# EasyEDA Pro project 4040M主控板v1.0_原理图.eprj

# Schematic 原理图
Board Name: MCU+U盘; Create Date: 2024-04-22; Page Name: 主控MCU; Project Name: 4040M主控板v1.0_原理图; Schematic Name: 原理图; Update Date: 2026-04-30; Company: 嘉立创EDA; Page Size: A3; Version: V1.0
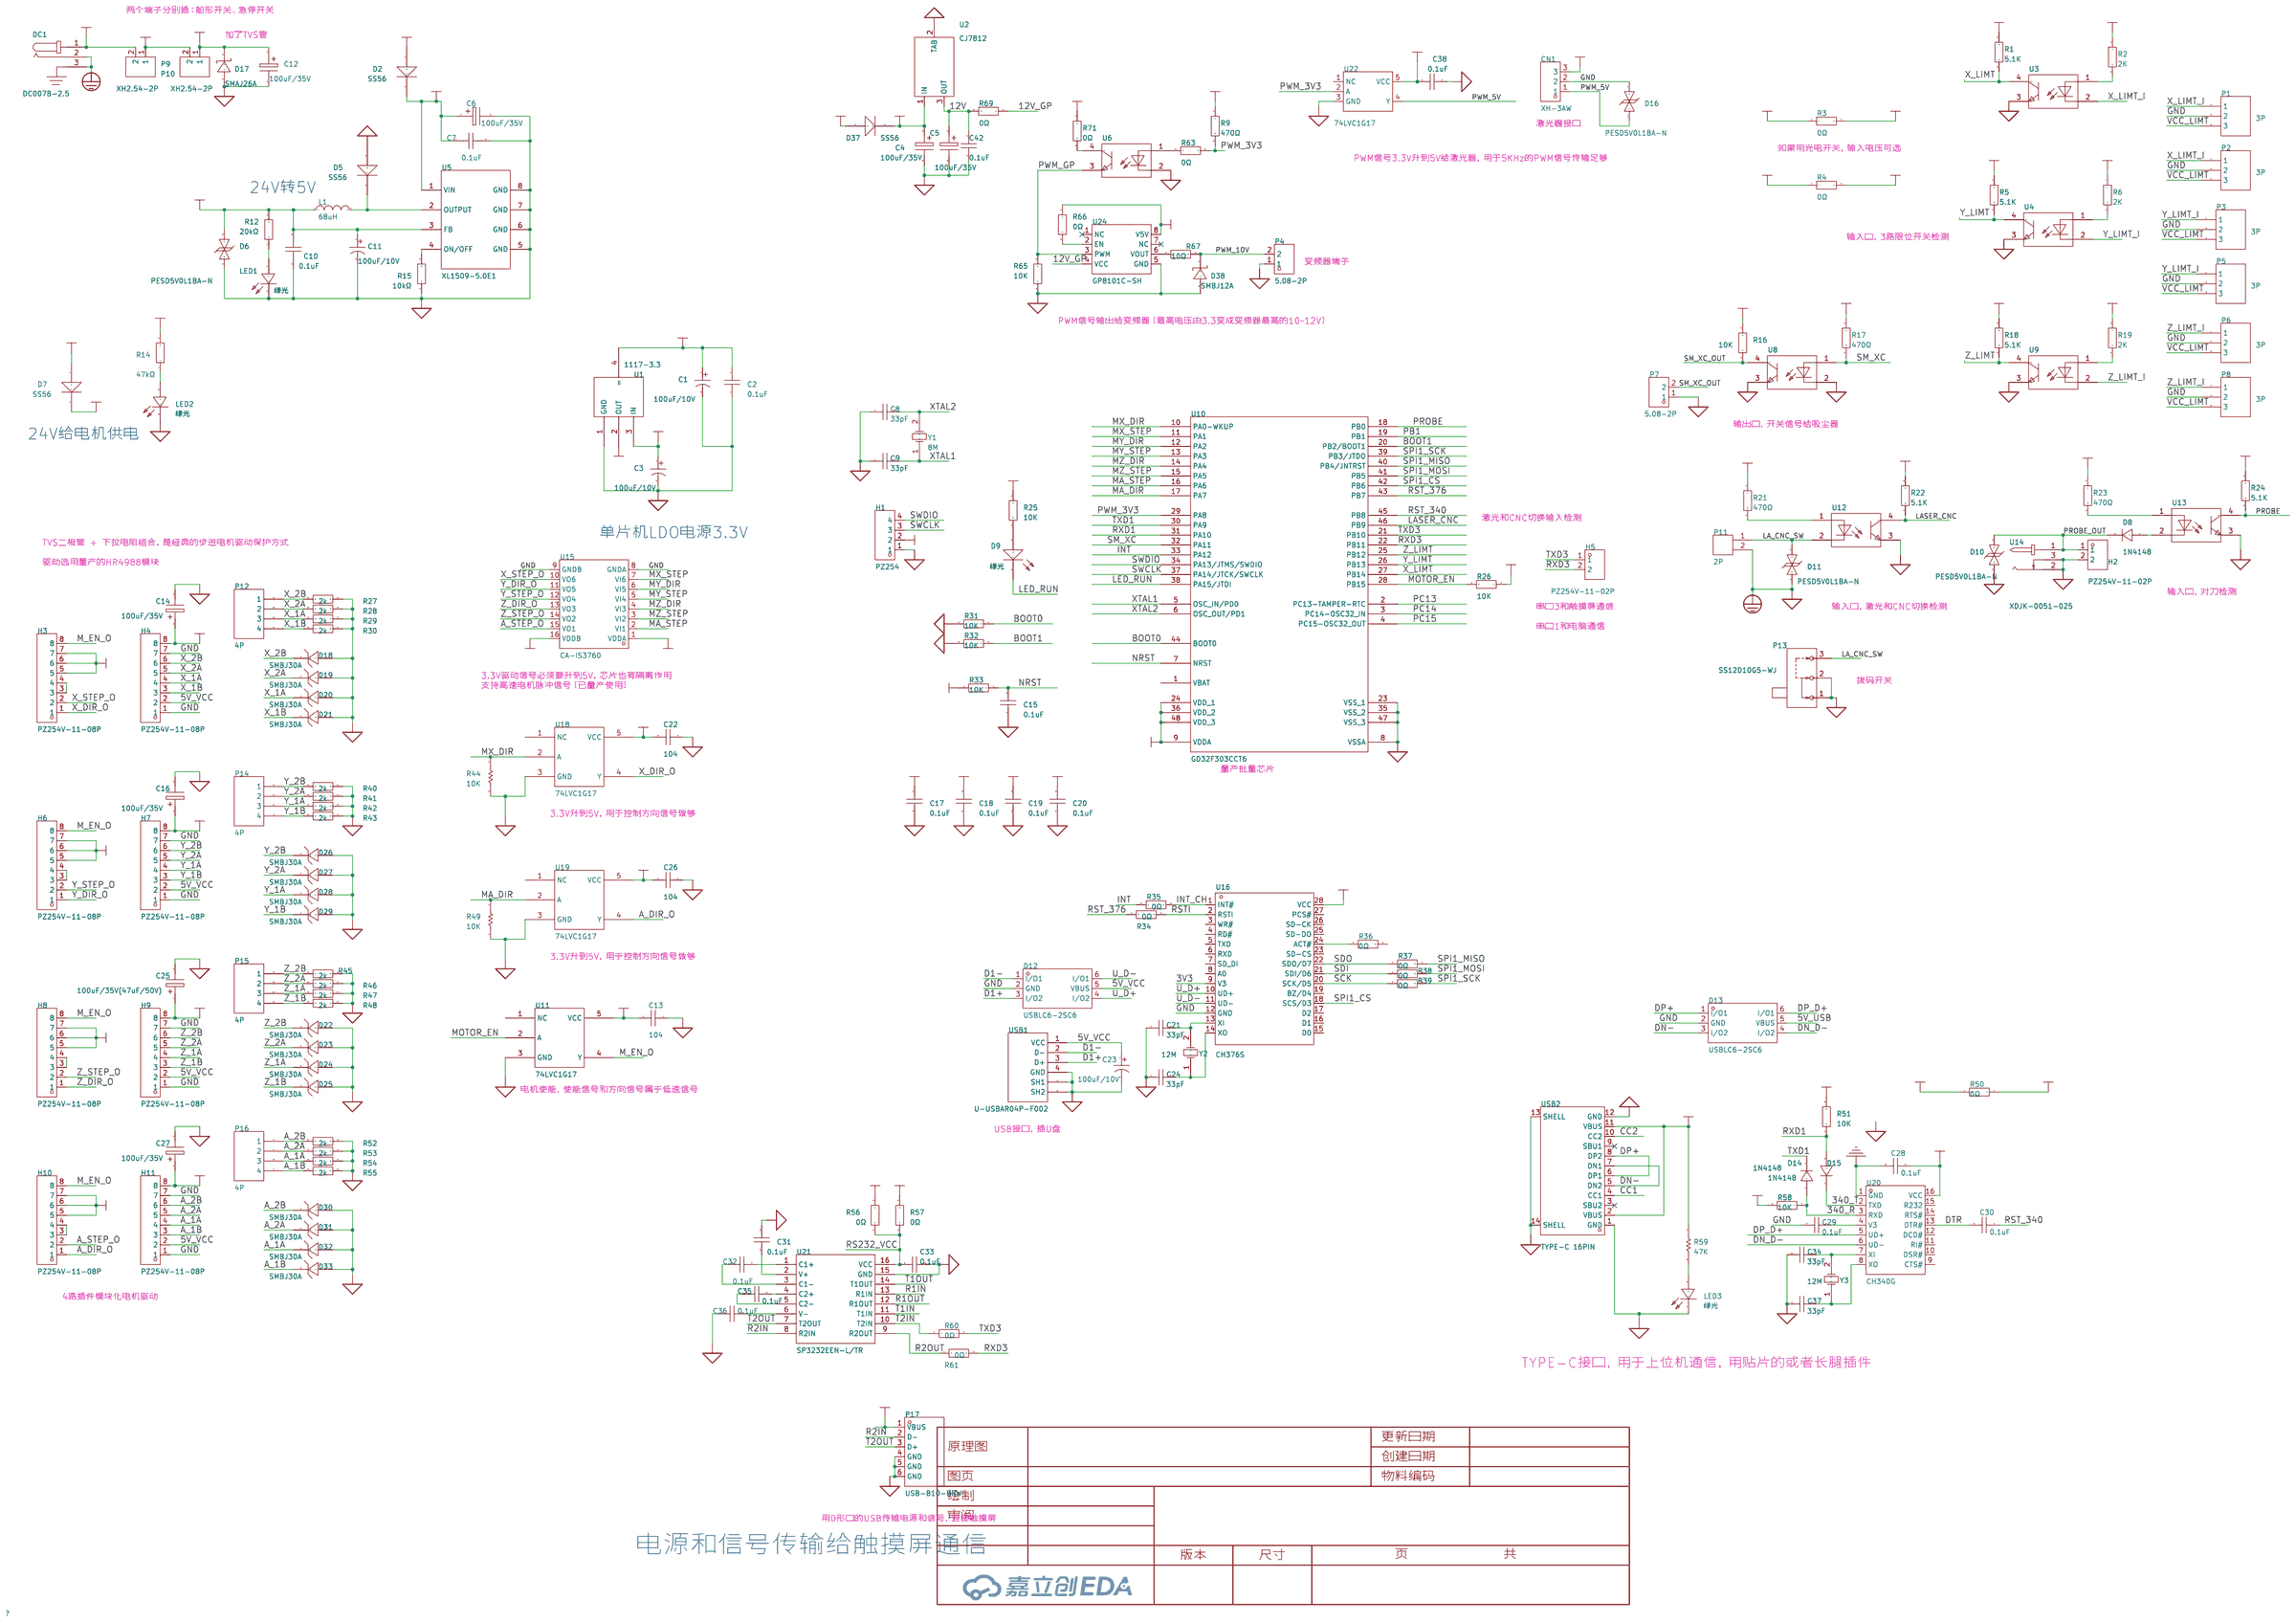
[diagram p0: schematic sheet]

## Parts
C1  100uF/10V  [CAP-SMD_BD5.0-L5.3-W5.3-RD]
C2  0.1uF  [C0603]
C3  100uF/10V  [CAP-SMD_BD5.0-L5.3-W5.3-RD]
C4  100uF/35V  [电解电容贴片6X6]
C5  100uF/35V  [电解电容贴片6X6]
C6  100uF/35V  [电解电容贴片6X6]
C7  0.1uF  [C0603]
C8  33pF  [C0603]
C9  33pF  [C0603]
C10  0.1uF  [C0603]
C11  100uF/10V  [CAP-SMD_BD5.0-L5.3-W5.3-RD]
C12  100uF/35V  [电解电容贴片6X6]
C13  104  [0603C]
C14  100uF/35V  [电解电容贴片6X6]
C15  0.1uF  [C0603]
C16  100uF/35V  [电解电容贴片6X6]
C17  0.1uF  [C0603]
C18  0.1uF  [C0603]
C19  0.1uF  [C0603]
C20  0.1uF  [C0603]
C21  33pF  [C0603]
C22  104  [0603C]
C23  100uF/10V  [CAP-SMD_BD5.0-L5.3-W5.3-RD]
C24  33pF  [C0603]
C25  100uF/35V(47uF/50V)  [电解电容贴片6X6]
C26  104  [0603C]
C27  100uF/35V  [电解电容贴片6X6]
C28  0.1uF  [C0603]
C29  0.1uF  [C0603]
C30  0.1uF  [C0603]
C31  0.1uF  [C0603]
C32  0.1uF  [C0603]
C33  0.1uF  [C0603]
C34  33pF  [C0603]
C35  0.1uF  [C0603]
C36  0.1uF  [C0603]
C37  33pF  [C0603]
C38  0.1uF  [C0603]
C42  0.1uF  [C0603]
CN1  XH-3AW  [CONN-TH_3P-P2.54_HCTL_XH-3AW]
D2  SS56  [SMA]
D5  SS56  [SMA]
D6  PESD5V0L1BA-N  [SOD-323_L1.8-W1.3-LS2.5-BI]
D7  SS56  [SMA]
D8  1N4148  [SOD-323_L1.8-W1.3-LS2.5-RD]
D9  绿光  [0603LED]
D10  PESD5V0L1BA-N  [SOD-323_L1.8-W1.3-LS2.5-BI]
D11  PESD5V0L1BA-N  [SOD-323_L1.8-W1.3-LS2.5-BI]
D12  USBLC6-2SC6  [SOT-23-6_L2.9-W1.6-P0.95-LS2.8-BL]
D13  USBLC6-2SC6  [SOT-23-6_L2.9-W1.6-P0.95-LS2.8-BL]
D14  1N4148  [SOD-323_L1.8-W1.3-LS2.5-RD]
D15  1N4148  [SOD-323_L1.8-W1.3-LS2.5-RD]
D16  PESD5V0L1BA-N  [SOD-323_L1.8-W1.3-LS2.5-BI]
D17  SMAJ26A  [SMA_L4.4-W2.8-LS5.1-RD]
D18  SMBJ30A  [SMB_L4.6-W3.6-LS5.3-RD]
D19  SMBJ30A  [SMB_L4.6-W3.6-LS5.3-RD]
D20  SMBJ30A  [SMB_L4.6-W3.6-LS5.3-RD]
D21  SMBJ30A  [SMB_L4.6-W3.6-LS5.3-RD]
D22  SMBJ30A  [SMB_L4.6-W3.6-LS5.3-RD]
D23  SMBJ30A  [SMB_L4.6-W3.6-LS5.3-RD]
D24  SMBJ30A  [SMB_L4.6-W3.6-LS5.3-RD]
D25  SMBJ30A  [SMB_L4.6-W3.6-LS5.3-RD]
D26  SMBJ30A  [SMB_L4.6-W3.6-LS5.3-RD]
D27  SMBJ30A  [SMB_L4.6-W3.6-LS5.3-RD]
D28  SMBJ30A  [SMB_L4.6-W3.6-LS5.3-RD]
D29  SMBJ30A  [SMB_L4.6-W3.6-LS5.3-RD]
D30  SMBJ30A  [SMB_L4.6-W3.6-LS5.3-RD]
D31  SMBJ30A  [SMB_L4.6-W3.6-LS5.3-RD]
D32  SMBJ30A  [SMB_L4.6-W3.6-LS5.3-RD]
D33  SMBJ30A  [SMB_L4.6-W3.6-LS5.3-RD]
D37  SS56  [SMA]
D38  SMBJ12A  [SMB_L4.6-W3.6-LS5.4-RD]
DC1  DC007B-2.5  [DC-IN-TH_HX-DC007B-2.5]
H1  PZ254  [HDR-TH_4P-P2.54-V-M]
H2  PZ254V-11-02P  [HDR-TH_2P-P2.54-V-M]
H3  PZ254V-11-08P  [HDR-TH_8P-P2.54-V-M]
H4  PZ254V-11-08P  [HDR-TH_8P-P2.54-V-M]
H5  PZ254V-11-02P  [HDR-TH_2P-P2.54-V-M]
H6  PZ254V-11-08P  [HDR-TH_8P-P2.54-V-M]
H7  PZ254V-11-08P  [HDR-TH_8P-P2.54-V-M]
H8  PZ254V-11-08P  [HDR-TH_8P-P2.54-V-M]
H9  PZ254V-11-08P  [HDR-TH_8P-P2.54-V-M]
H10  PZ254V-11-08P  [HDR-TH_8P-P2.54-V-M]
H11  PZ254V-11-08P  [HDR-TH_8P-P2.54-V-M]
L1  68uH  [IND-SMD_L7.0-W7.0_SMDRI74-330MT]
LED1  绿光  [LED0603-RD]
LED2  绿光  [LED0603-RD]
LED3  绿光  [LED0603-RD]
P1  3P  [HDR1X3_CON]
P2  3P  [HDR1X3_CON]
P3  3P  [HDR1X3_CON]
P4  5.08-2P  [CONN-TH_KF2EDG15R-5.08-2P]
P5  3P  [HDR1X3_CON]
P6  3P  [HDR1X3_CON]
P7  5.08-2P  [CONN-TH_KF2EDG15R-5.08-2P]
P8  3P  [HDR1X3_CON]
P9  XH2.54-2P  [CONN-TH_XH2.54-2P]
P10  XH2.54-2P  [CONN-TH_XH2.54-2P]
P11  2P  [HDR1X2_CON]
P12  4P  [HDR1X4_CON]
P13  SS12D10G5-WJ  [SW-TH_3P-SS12D06-1]
P14  4P  [HDR1X4_CON]
P15  4P  [HDR1X4_CON]
P16  4P  [HDR1X4_CON]
P17  USB-B10-BRW  [USB-B-TH_USB-B10-BRW]
R1  47K  [R0603]
R2  4.7K  [R0603]
R3  0Ω  [R0603]
R4  0Ω  [R0603]
R5  47K  [R0603]
R6  4.7K  [R0603]
R9  47K  [R0603]
R12  20kΩ  [R0603]
R14  47kΩ  [R0603]
R15  10kΩ  [R0603]
R16  10K  [R0603]
R17  47K  [R0603]
R18  47K  [R0603]
R19  4.7K  [R0603]
R21  470Ω  [R0603]
R22  10K  [R0603]
R23  470Ω  [R0603]
R24  10K  [R0603]
R25  10K  [R0603]
R26  10K  [R0603]
R27  2k  [R0603]
R28  2k  [R0603]
R29  2k  [R0603]
R30  2k  [R0603]
R31  10K  [R0603]
R32  10K  [R0603]
R33  10K  [R0603]
R34  0Ω  [R0603]
R35  0Ω  [R0603]
R36  0Ω  [R0603]
R37  0Ω  [R0603]
R38  0Ω  [R0603]
R39  0Ω  [R0603]
R40  2k  [R0603]
R41  2k  [R0603]
R42  2k  [R0603]
R43  2k  [R0603]
R44  10K  [0603R]
R45  2k  [R0603]
R46  2k  [R0603]
R47  2k  [R0603]
R48  2k  [R0603]
R49  10K  [0603R]
R50  0Ω  [R0603]
R51  10K  [R0603]
R52  2k  [R0603]
R53  2k  [R0603]
R54  2k  [R0603]
R55  2k  [R0603]
R56  0Ω  [R0603]
R57  0Ω  [R0603]
R58  10K  [R0603]
R59  47K  [10]
R60  0Ω  [R0603]
R61  0Ω  [R0603]
R63  0Ω  [R0603]
R65  10K  [R0603]
R66  0Ω  [R0603]
R67  10Ω  [R0603]
R69  0Ω  [R0603]
R71  47K  [R0603]
U1  1117-3.3  [SOT-223]
U2  CJ7812  [TO-263-2_L10.1-W9.1-P5.08-LS15.2-TL]
U3  LTV-357T-C  [SOP-4_L4.4-W3.9-P2.54-LS7.0-TL]
U4  LTV-357T-C  [SOP-4_L4.4-W3.9-P2.54-LS7.0-TL]
U5  XL1509-5.0E1  [ESOP-8_L4.9-W3.9-P1.27-LS6.0-BL-EP]
U6  LTV-357T-C  [SOP-4_L4.4-W3.9-P2.54-LS7.0-TL]
U8  LTV-357T-C  [SOP-4_L4.4-W3.9-P2.54-LS7.0-TL]
U9  LTV-357T-C  [SOP-4_L4.4-W3.9-P2.54-LS7.0-TL]
U10  GD32F303CCT6  [LQFP48]
U11  74LVC1G17  [SOT-23-5]
U12  LTV-357T-C  [SOP-4_L4.4-W3.9-P2.54-LS7.0-TL]
U13  LTV-357T-C  [SOP-4_L4.4-W3.9-P2.54-LS7.0-TL]
U14  XDJK-0051-025  [DC-IN-TH_XDJK-0051-025]
U15  CA-IS3760  [SOIC-16_L9.9-W3.9-P1.27-LS6.0-BL]
U16  CH376S  [SOIC-28_L17.9-W7.5-P1.27-LS10.3-BL]
U18  74LVC1G17  [SOT-23-5]
U19  74LVC1G17  [SOT-23-5]
U20  CH340G  [SOIC-16_L9.9-W3.9-P1.27-LS6.0-BL]
U21  SP3232EEN-L/TR  [SOIC-16_L9.9-W3.9-P1.27-LS6.0-BL]
U22  74LVC1G17  [SOT-23-5]
U24  GP8101C-SH  [SOIC-8_L4.9-W3.9-P1.27-LS6.0-BL]
USB1  U-USBAR04P-F002  [USB-A-TH_USB-302-T]
USB2  TYPE-C 16PIN  [USB-C-SMD_TYPE-C-6PIN+]
Y1  8M  [晶振贴片]
Y2  12M  [晶振贴片49SSMD]
Y3  12M  [晶振贴片49SSMD]

## Library data of the parts
C1 C3 C11 C23 = CS1A101M-CRD54: 容值:100uF;精度:±20%;额定电压:10V;电容体直径:5mm;电容体长度:5.4mm;纹波电流:-;等效串联电阻:-;工作寿命:1000hrs@105℃;工作温度:-40℃~+105℃;; LCSC Part Name: 100uF ±20% 10V; Supplier Part: C96182; Manufacturer: ST(先科); Supplier Footprint: SMD,5x5.4mm; JLCPCB Part Class: Extended Part; Datasheet: https://atta.szlcsc.com/upload/public/pdf/source/20170304/1488621207726.pdf; Supplier: LCSC; Tolerance: ±20%; Rated Voltage: 10V; φD: 5mm; L: 5.4mm; Lifetime @ Temp: 1000hrs@105℃; Operating Temperature: -40℃~+105℃
C2 C15 C17-C20 C28-C33 C35 C36 C38 C42 = 0603B682K500NT: 容值:6.8nF;精度:±10%;额定电压:50V;温度系数:X7R;; LCSC Part Name: 6.8nF ±10% 50V; Supplier Part: C1631; Manufacturer: FH(风华); Supplier Footprint: 0603; JLCPCB Part Class: 基础库; Datasheet: https://item.szlcsc.com/datasheet/0603B682K500NT/1983.html; Supplier: LCSC; Tolerance: ±10%; Voltage Rating: 50V; Temperature Coefficient: X7R
C4-C6 C12 C14 C16 C25 C27 = 100uF/35V: Origin Footprint 2: X47U; Origin Footprint 1: 电解电容贴片6x6; Design Item ID: ELECTRO1; Library Name: *
C7 C10 = 0603B822K500NT: 容值:8.2nF;精度:±10%;额定电压:50V;温度系数:X7R;; LCSC Part Name: 8.2nF ±10% 50V; Supplier Part: C1322360; Manufacturer: FH(风华); Supplier Footprint: 0603; JLCPCB Part Class: 基础库; Datasheet: https://item.szlcsc.com/datasheet/0603B822K500NT/1413077.html; Supplier: LCSC; Tolerance: ±10%; Voltage Rating: 50V; Temperature Coefficient: X7R
C8 C9 C21 C24 C34 C37 = CL10C120JB8NNNC: 容值:12pF;精度:±5%;额定电压:50V;温度系数:C0G;; LCSC Part Name: 12pF ±5% 50V; Supplier Part: C38523; Manufacturer: SAMSUNG(三星); Supplier Footprint: 0603; JLCPCB Part Class: 基础库; Datasheet: https://item.szlcsc.com/datasheet/CL10C120JB8NNNC/39506.html; Supplier: LCSC; Tolerance: ±5%; Voltage Rating: 50V; Temperature Coefficient: C0G
C13 C22 C26 = 104: Capacitor (Semiconductor SIM Model); Published: 8-Jun-2000; LatestRevisionDate: 17-Jul-2002; LatestRevisionNote: Re-released for DXP Platform.; PackageReference: C1206; Publisher: Altium Limited; Origin Footprint 2: C1206; Origin Footprint 3: 0402; Origin Footprint 4: 1310[0504]; Origin Footprint 5: 1608[0603]; Origin Footprint 6: C1210; Origin Footprint 7: C0805; Origin Footprint 8: C1206; Origin Footprint 9: 0805; Origin Footprint 10: 0805L; Design Item ID: Cap Semi; Library Name: Miscellaneous Devices
CN1 = XH-3AW_C2908612: LCSC Part Name: 1x3P 间距:2.54mm 弯插 系列:XH; Supplier Part: C2908612; Manufacturer: HCTL(华灿天禄); Supplier Footprint: 弯插,P=2.5mm; JLCPCB Part Class: 扩展库; Datasheet: https://item.szlcsc.com/datasheet/XH-3AW/3184383.html; Supplier: LCSC; Pins Structure: 1x3P; Pitch: 2.54mm; Mounting Type: 弯插; Reference Series: XH; Number of Pins: 3P; Number of Rows: 1; Number of PINs Per Row: 3; Current Rating: 3A; Contact Material: 黄铜; Contact Plating: 锡; Operating Temperature: -25℃~+85℃; Voltage Rating: 250V; Plastic Material: PA66; Flame Retardant Rating: UL94V-0; Z-Height of the Board: 5.9mm; Y-Width of Bottom Edge on Board: 7mm
D2 D5 D7 D37 = SS56: Design Item ID: 1N4148; Library Name: SCH封装库
D6 D10 D11 D16 = PESD5V0S1BBN: 极性:Bidirectional;反向关断电压（典型值）:5V (Max);击穿电压（最小值）:6V;箝位电压:15V;峰值脉冲电流（10/1000us）:5A (8/20us);; Supplier Part: C314264; Manufacturer: BORN伯恩半导体; Supplier Footprint: SOD-523; JLCPCB Part Class: Extended Part; Datasheet: https://atta.szlcsc.com/upload/public/pdf/source/20181015/C314264_F9AC5761AC2631DA841FBD1D9C6821E3.pdf; Supplier: LCSC; Polarity: Bidirectional; Voltage - Reverse Standoff (Typ): 5V (Max); Voltage - Breakdown (Min): 6V; Voltage - Clamping (Max) @ Ipp: 15V; Current - Peak Pulse (10/1000μs): 5A (8/20us)
D8 D14 D15 = 1N4148WS_C2128: 二极管配置:独立式;正向压降(Vf):1.25V@150mA;直流反向耐压(Vr):100V;整流电流:150mA;反向恢复时间(Trr):4ns;; LCSC Part Name: 丝印T4 1N4148WS; Supplier Part: C2128; Manufacturer: CJ(江苏长电/长晶); Supplier Footprint: SOD-323; JLCPCB Part Class: 基础库; Datasheet: https://item.szlcsc.com/datasheet/1N4148WS/2485.html; Supplier: LCSC; Diode Configuration: 独立式; Voltage - Forward(Vf@If): 1.25V@150mA; Voltage - DC Reverse(Vr): 100V; Current - Rectified: 150mA; Pd - Power Dissipation: 200mW; Reverse Leakage Current (Ir): 1uA@75V; Reverse Recovery Time (trr): 4ns; Non-Repetitive Peak Forward Surge Current: 2A
D9 = 绿光: Origin Footprint 2: LED(小); Design Item ID: LED; Library Name: SCH封装库
D12 D13 = USBLC6-2SC6: 最大钳位电压:15V;击穿电压:6V;; Supplier Part: C2687116; Manufacturer: UMW(友台半导体); Supplier Footprint: SOT-23-6; JLCPCB Part Class: 扩展库; Datasheet: https://atta.szlcsc.com/upload/public/pdf/source/20231109/512642D850D9873E7C519F71E85B9A10.pdf; Supplier: LCSC; Maximum Clamping Voltage: 15V; Breakdown Voltage: 6V; Number of Lines: 双路; Type: ESD
D17 = SMAJ26A: LCSC Part Name: 单向TVS 26V截止 9.5A峰值脉冲; Supplier Part: C356747; Manufacturer: JJW(捷捷微); Supplier Footprint: SMA(DO-214AC); JLCPCB Part Class: 扩展库; Datasheet: https://atta.szlcsc.com/upload/public/pdf/source/20190118/C364660_B64EB57815AD6306F3CC88F8ECD7A3CF.pdf; Supplier: LCSC; Reverse Stand-Off Voltage (Vrwm): 26V; Maximum Clamping Voltage: 42.1V; Peak Pulse Current (Ipp): 9.5A; Breakdown Voltage: 28.9V; Type: TVS
D18-D33 = SMBJ30A: Supplier Part: C266337; Manufacturer: GOOD-ARK(固锝); Supplier Footprint: SMB(DO-214AA); JLCPCB Part Class: 扩展库; Datasheet: https://atta.szlcsc.com/upload/public/pdf/source/20180930/C280378_8CA185CE38301EC6FBCF9A1063F1773A.pdf; Supplier: LCSC; Reverse Stand-Off Voltage (Vrwm): 30V; Maximum Clamping Voltage: 48.4V; Peak Pulse Current (Ipp): 12.4A; Breakdown Voltage: 33.3V; Type: TVS
D38 = SMBJ12A: Supplier Part: C356757; Manufacturer: JJW(捷捷微); Supplier Footprint: SMB(DO-214AA); Datasheet: https://atta.szlcsc.com/upload/public/pdf/source/20190118/C364661_581AFCFF6ECC065E7F89B606E0837F4E.pdf; Supplier: LCSC; Reverse Stand-Off Voltage (Vrwm): 12V; Maximum Clamping Voltage: 19.9V; Peak Pulse Current (Ipp): 30.2A; Breakdown Voltage: 13.3V; Reverse Leakage Current (Ir): 1uA; Type: TVS
DC1 = DC007B-2.5: 连接器类型:DC电源插座;安装方式:弯插;触点内径:2.5mm;触点外径:7.7mm;额定电流:5A;额定电压:20V;工作温度:-25℃~+70℃;; LCSC Part Name: DC电源插座 内径:2.5mm 外径:7.7mm; Supplier Part: C17701685; Manufacturer: SHOU HAN(首韩); Supplier Footprint: 插件; JLCPCB Part Class: 扩展库; Datasheet: https://atta.szlcsc.com/upload/public/pdf/source/20230912/B85EC3863CDA4EDD9FBFF38F4F2C356A.pdf; Supplier: LCSC; Connector Type: DC电源插座; Mounting Type: 弯插; Inside Contact Diameter: 2.5mm; Outside Contact Diameter: 7.7mm; Current Rating: 5A; Voltage Rating (Max): 20V; Operating Temperature: -25℃~+70℃
H1 = PZ254V-11-04P: 插针结构:1x4P;间距:2.54mm;行距:-;圆针/方针:方针;安装方式:直插;排数:单排;总PIN位数:4P;额定电流:3A;额定电压:250V;配合针长度:6mm;塑高:2.5mm;端接针长度:3mm;触头材质:-;工作温度:-40℃~+105℃;颜色:黑色;; LCSC Part Name: 1x4P 间距:2.54mm 方针 直插; Supplier Part: C2691448; Manufacturer: XFCN(兴飞); Supplier Footprint: 插件,P=2.54mm; JLCPCB Part Class: 扩展库; Datasheet: https://item.szlcsc.com/datasheet/PZ254V-11-04P/2801085.html; Supplier: LCSC; Pin Structure: 1x4P; Pitch: 2.54mm; Circluar Pins/Square Pins: 方针; Mounting Type: 直插; Number of Rows: 单排; Number of Pins: 4P; Current Rating: 3A; Voltage Rating (Max): 250V; Length of Mating Pin: 6mm; Insulation Height: 2.5mm; Length of End Connection Pin: 3mm; Operating Temperature: -40℃~+105℃; Color: 黑色
H2 H5 = PZ254V-11-02P: 插针结构:1x2P;间距:2.54mm;行距:-;圆针/方针:方针;安装类型:直插;排数:单排;总PIN位数:2P;额定电流:-;额定电压:-;配合针长度:6mm;塑高:2.5mm;端接针长度:3mm;触头材质:黄铜;触头镀层:-;工作温度范围:-40℃~+105℃;颜色:黑色;; LCSC Part Name: 间距:2.54mm 1x2P 直插 方针; Supplier Part: C492401; Manufacturer: XFCN(兴飞); Supplier Footprint: 插件,P=2.54mm; JLCPCB Part Class: 扩展库; Datasheet: https://atta.szlcsc.com/upload/public/pdf/source/20200309/C492401_A812433581A9B211A7FFA413ADDFF0E5.pdf; Supplier: LCSC; Pin Structure: 1x2P; Pitch: 2.54mm; Circluar Pins/Square Pins: 方针; Mounting Type: 直插; Number of Rows: 单排; Number of Pins: 2P; Length of Mating Pin: 6mm; Insulation Height: 2.5mm; Length of End Connection Pin: 3mm; Contact Material: 黄铜; Operating Temperature Range: -40℃~+105℃; Color: 黑色
H3 H4 H6-H11 = PZ254V-11-08P: LCSC Part Name: 间距:2.54mm 1x8P 直插 方针; Supplier Part: C492407; Manufacturer: XFCN(兴飞); Supplier Footprint: 插件,P=2.54mm; JLCPCB Part Class: 扩展库; Datasheet: https://atta.szlcsc.com/upload/public/pdf/source/20200309/C492407_83A6FB26A2233368EDB9516968EC6149.pdf; Supplier: LCSC; Pin Structure: 1x8P; Pitch: 2.54mm; Circluar Pins/Square Pins: 方针; Mounting Type: 直插; Number of Rows: 单排; Number of Pins: 8P; Length of Mating Pin: 6mm; Insulation Height: 2.5mm; Length of End Connection Pin: 3mm; Contact Material: 黄铜; Operating Temperature Range: -40℃~+105℃; Color: 黑色
L1 = SMDRI74-330MT: 电感值:33uH;精度:±20%;额定电流:960mA;饱和电流(Isat):1.8A;类型:屏蔽电感;; LCSC Part Name: 33uH±20%1.8A; Supplier Part: C49625; Manufacturer: SXN(顺翔诺); Supplier Footprint: SMD,7.5x7.5mm; JLCPCB Part Class: 扩展库; Datasheet: https://atta.szlcsc.com/upload/public/pdf/source/20210810/6F96FDC19AA308DD2AD166FFB9640E87.pdf; Supplier: LCSC; Tolerance: ±20%; Rated Current: 960mA; Saturation Current (Isat): 1.8A; DC Resistance (DCR): 170mΩ; Type: 屏蔽电感
LED1-LED3 = KT-0603R: 灯头类型:-;发光颜色:红色;正向压降(Vf):1.8V~2.4V;功率:40mW;正向电流:20mA;波长:615nm~630nm;二极管配置:独立二极管;透镜颜色:无色透明透镜;色温:-;发光强度:300mcd;发光角度:120°;载带方式:-;工作温度:-40℃~+85℃;; LCSC Part Name: 0603 红灯 高亮; Supplier Part: C2286; Manufacturer: KENTO; Supplier Footprint: 0603; JLCPCB Part Class: 基础库; Datasheet: https://item.szlcsc.com/datasheet/KT-0603R/2659.html; Supplier: LCSC; Illumination Color: 红色; Voltage - Forward(Vf): 1.8V~2.4V; Power(Watts): 40mW; Forward Current: 20mA; Wavelength - Dominant: 615nm~630nm; Peak Wavelength: 645nm; Diode Configuration: 独立二极管; Lens Color: 无色透明透镜; Luminous Intensity: 300mcd; Viewing Angle: 120°; Operating Temperature: -40℃~+85℃
P1-P3 P5 P6 P8 = 3P: Library Name: SCH封装库
P4 P7 = KF2EDG15R-5.08-2P: LCSC Part Name: 卡扣固定 1x2P 5.08mm 排数:1 每排P数:2; Supplier Part: C6393959; Manufacturer: KEFA(科发); Supplier Footprint: 插件,P=5.08mm; JLCPCB Part Class: 扩展库; Datasheet: https://item.szlcsc.com/datasheet/KF2EDG15R-5.08-2P/7344965.html; Supplier: LCSC; Connector Type: 板端/插座-闭口; Termination Style: 卡扣固定; Number of Positions or Pins: 1x2P; Pitch: 5.08mm; Color: 绿色; Mounting Type: 弯插; Number of Pins: 2P; Number of Rows: 1; Number of PINs Per Row: 2; Current Rating: 8A; Voltage Rating (Max): 300V; Operating Temperature: -40℃~+105℃
P9 P10 = XH2.54直插座-2P: Supplier Part: C9900016957; Supplier Footprint: XH2.54-2; JLCPCB Part Class: 扩展库; Supplier: LCSC
P11 = 2P: Library Name: SCH--װ--
P12 P14-P16 = 4P: Library Name: SCH封装库
P13 = SS12D10G5-WJ: LCSC Part Name: SS12D10G5弯脚(高弯); Supplier Part: C7431058; Manufacturer: SHOU HAN(首韩); Supplier Footprint: 弯插,12.7x6.7mm; JLCPCB Part Class: 扩展库; Datasheet: https://item.szlcsc.com/datasheet/SS12D10G5-WJ/8431410.html; Supplier: LCSC; Circuit: 单刀双掷; Actuator Style: 矩形柱状; Termination Style: PC引脚; Length: 12.7mm; Width: 6.7mm; Switch Height: 11.4mm; Mounting Type: 弯插; Actuator Color: 黑色; Current Rating: 2A; Voltage Rating: 125V; Life: 3千次; Operating Temperature: -25℃~+70℃
P17 = USB-B10-BRW: 连接器类型:Type-B;标准:USB 2.0;公母:母;端口数量:1;触点数量:4P;安装方式:弯插;额定电流 - 电源:1.5A;工作温度范围:-20℃~+70℃;焊接温度(最大值):260℃;; LCSC Part Name: Type-B母弯插; Supplier Part: C720549; Manufacturer: XUNPU(讯普); Supplier Footprint: 插件; JLCPCB Part Class: 扩展库; Datasheet: https://atta.szlcsc.com/upload/public/pdf/source/20200812/C720549_53E9294752E2933874870440E626C579.pdf; Supplier: LCSC; Connector Type: Type-B; Standard: USB2.0; Gender: 母; Number of Ports: 1; Number of Contacts: 4P; Mounting Style: 弯插; Current Rating - Power (Max): 1.5A; Operating Temperature Range: -20℃~+70℃; Soldering Temperature(Max): 260℃
R1-R6 R9 R12 R14-R19 R21-R43 R45-R48 R50-R58 R60 R61 R63 R65-R67 R69 R71 = 0603WAF2402T5E: 电阻类型:厚膜电阻;阻值:24kΩ;精度:±1%;功率:100mW;工作电压:75V;温度系数:±100ppm/℃;; LCSC Part Name: 24kΩ ±1% 100mW 厚膜电阻; Supplier Part: C23352; Manufacturer: UNI-ROYAL(厚声); Supplier Footprint: 0603; JLCPCB Part Class: 基础库; Datasheet: https://item.szlcsc.com/datasheet/0603WAF2402T5E/24085.html; Supplier: LCSC; Type: 厚膜电阻; Tolerance: ±1%; Power(Watts): 100mW; Voltage-Supply(Max): 75V; Temperature Coefficient: ±100ppm/℃; Operating Temperature: -55℃~+155℃
R44 R49 = 10K: Resistor; Published: 8-Jun-2000; LatestRevisionDate: 17-Jul-2002; LatestRevisionNote: Re-released for DXP Platform.; PackageReference: AXIAL-0.3; Publisher: Altium Limited; Origin Footprint 2: AXIAL-0.3; Origin Footprint 3: R0805; Origin Footprint 4: 0805R; Design Item ID: RES; Library Name: SCH--װ--
R59 = 10K: Resistor; Published: 8-Jun-2000; LatestRevisionDate: 17-Jul-2002; LatestRevisionNote: Re-released for DXP Platform.; PackageReference: AXIAL-0.3; Publisher: Altium Limited; Origin Footprint 2: AXIAL-0.3; Origin Footprint 3: R0805; Origin Footprint 4: 0805R; Origin Footprint 1: 0603R; Design Item ID: RES; Library Name: SCH封装库
U1 = 1117-3.3: Design Item ID: LM1117; Library Name: Party600
U2 = CJ7812_C145151: 输出类型:固定;工作电压:35V;输出电压:12V;输出电流:1.5A;电源纹波抑制比(PSRR):71dB@(120Hz);输出极性:正极;; LCSC Part Name: 输入35V 输出12V 1.5A; Supplier Part: C145151; Manufacturer: CJ(江苏长电/长晶); Supplier Footprint: TO-263-2; JLCPCB Part Class: 扩展库; Datasheet: https://atta.szlcsc.com/upload/public/pdf/source/20171129/C145151_15119539756991151329.pdf; Supplier: LCSC; Output Type: 固定; Voltage - Supply: 35V; Output Voltage: 12V; Output Current: 1.5A; Power Supply Rejection Ratio (PSRR): 71dB@(120Hz); Voltage Dropout: 2V@(1A); standby current: 4.3mA; Operating Temperature: -25℃~+125℃; Output Configuration: 正极; Number of Outputs: 1
U3 U4 U6 U8 U9 U12 U13 = LTV-357T-C: 输入电压类型:DC;正向电压:1.2V;输出电流:50mA;隔离电压(rms):3.75kV;反向电压:6V;接收端电压:35V;输出通道数:1;集射极饱和电压(Vce(sat)@Ic,IF):200mV@1mA,20mA;; Supplier: LCSC; Manufacturer: LITEON(光宝); Supplier Part: C119091; JLCPCB Part Class: 扩展库; LCSC Part Name: DC输入隔离电压(rms):3750V; Supplier Footprint: SOP-4-2.54mm; Datasheet: https://atta.szlcsc.com/upload/public/pdf/source/20170930/C133128_1506736380934997376.pdf; Input voltage type: DC; Output Type: 光电三极管; Forward Voltage: 1.2V; Output Current: 50mA; Isolation Voltage(rms): 3.75kV; Reverse Voltage: 6V; Receiving End Voltage: 35V; Number of Outputs: 1; Collector-Emitter Saturation Voltage (Vce(sat)@Ic,IF): 200mV@1mA,20mA; Rise time: 4us@2mA,100Ω; Fall time: 3us@2mA,100Ω; Operating Temperature: -55℃~+110℃
U5 = XL1509-5.0E1: 功能类型:降压型;同步整流:-;输出通道数:-;拓扑结构:-;输入电压:-;输出电流(最大值):-;开关频率:-;; LCSC Part Name: 降压型; Supplier Part: C61063; Manufacturer: XLSEMI(芯龙); Supplier Footprint: SOP-8_150mil; JLCPCB Part Class: Basic Part; Datasheet: https://atta.szlcsc.com/upload/public/pdf/source/20151020/1457707483545.pdf; Supplier: LCSC; Function: 降压型
U10 = STM32F103C8T6/CBT6: STM32 ARM-based 32-bit MCU with 32 Kbytes Flash, 48-pin LQFP, Industrial Temperature; Published: *; DatasheetVersion: *; PackageVersion: *; PackageReference: *; Publisher: *; PackageDescription: *; ComponentLink1Description: *; ComponentLink1URL: *; ComponentLink2Description: *; ComponentLink2URL: *; Origin Footprint 2: LQFP48_L; Origin Footprint 3: LQFP48_M; Design Item ID: STM32F103C6T6; Library Name: ST Microcontroller 32-Bit STM32 SCH
U11 U18 U19 = 74LVC1G04: Library Name: SCH--װ--
U14 = XDJK-0051-025: LCSC Part Name: DC电源插座 内径:2.1mm 外径:6.3mm; Supplier Part: C7498153; Manufacturer: LX(连欣科技); Supplier Footprint: 插件; JLCPCB Part Class: 扩展库; Datasheet: https://item.szlcsc.com/datasheet/XDJK-0051-025/8568595.html; Supplier: LCSC; Connector Type: DC电源插座; Mounting Type: 弯插; Inside Contact Diameter: 2.1mm; Outside Contact Diameter: 6.3mm; Current Rating: 3A; Voltage Rating (Max): 500V; Operating Temperature: -40℃~+85℃
U15 = CA-IS3760HN: LCSC Part Name: CA‐IS376x 高速六通道数字隔离器; Supplier Part: C19723481; Manufacturer: Chipanalog(川土微); Supplier Footprint: SOIC-16-NB; JLCPCB Part Class: 扩展库; Datasheet: https://atta.szlcsc.com/upload/public/pdf/source/20231222/0EEB57886E3672BACB4CFC71CD69856C.pdf; Supplier: LCSC
U16 = CH376S: 应用功能:-;USB协议版本:USB 2.0;数据速率:12Mbps;; LCSC Part Name: USB闪存盘和SD卡文件管理控制芯片; Supplier Part: C14166; Manufacturer: WCH(南京沁恒); Supplier Footprint: SOP-28-300mil; JLCPCB Part Class: 扩展库; Datasheet: https://item.szlcsc.com/datasheet/CH376S/14823.html; Supplier: LCSC; USB Protocol: USB 2.0; Voltage - Supply: 3.3V；5V; Data Rate: 12Mbps
U20 = CH340G: 应用功能:收发器;接口协议:USB 2.0;数据速率:2Mbps;; LCSC Part Name: USB转串口芯片 CH340; Supplier Part: C14267; Manufacturer: WCH(南京沁恒); Supplier Footprint: SOP-16; JLCPCB Part Class: 扩展库; Datasheet: https://atta.szlcsc.com/upload/public/pdf/source/20230530/6E401E9554E9F5311886CC8B3F89B62E.pdf; Supplier: LCSC; Applications Function: 收发器; Protocol: USB 2.0; Supply Voltage: 3.3V；5V; Data Rate: 2Mbps
U21 = SP3232EEN-L/TR: 类型:收发器;数据速率:235Kbps;; LCSC Part Name: True3.0V至5.5V RS-232收发器; Supplier Part: C9378; Manufacturer: MaxLinear(迈凌); Supplier Footprint: SOIC-16; JLCPCB Part Class: 扩展库; Datasheet: https://item.szlcsc.com/datasheet/SP3232EEN-L%252FTR/9907.html; Supplier: LCSC; Type: 收发器; Number of Drivers: 2; Number of Receivers: 2; Data Rate: 235Kbps; Voltage - Supply: 3V~5.5V; Operating Temperature: -40℃~+85℃
U22 = 74LVC1G17W5-TP: Supplier Part: C52098145; Manufacturer: TECH PUBLIC(台舟); JLCPCB Part Class: 扩展库; Datasheet: https://item.szlcsc.com/datasheet/74LVC1G17W5-TP/54871712.html; Supplier: LCSC; Input type: 施密特触发器; Voltage - Supply: 1.65V~5.5V; Number of Elements: 1; Number of Bits per Element: 1; Channel Type: 单向; Current - Output Low(IOL): 24mA; Current - Output High(IOH): 24mA; Logic Family: 74LVC; Operating Temperature: -40℃~+125℃; Quiescent Current: 10uA; Propagation Delay: 8.3ns@5V,50pF
U24 = GP8101C-SH: LCSC Part Name: PWM转0-10V模拟电压; Supplier Part: C49253868; Manufacturer: Guestgood(客益); Supplier Footprint: SOIC-8; JLCPCB Part Class: 扩展库; Datasheet: https://item.szlcsc.com/datasheet/GP8101C-SH/51686913.html; Supplier: LCSC; Number of Channels: 1; Voltage - Supply: 11V~32V; The Chip Type: PWM-模拟转换器; Operating Temperature: -40℃~+125℃; Voltage Reference: 内置; Voltage Reference Drift: 20ppm/℃; Data rate: 50kHz; Quiescent Current (Iq): 1.2mA
USB1 = U-USBAR04P-F002: 连接器类型:Type-A;协议标准:USB 2.0;公母:母;安装方式:弯插;触点数量:4P;端口数量:1;额定电流 - 电源:1.5A;工作温度:0℃~+50℃;; LCSC Part Name: USB母座; Supplier Part: C386736; Manufacturer: Ckmtw(灿科盟); Supplier Footprint: 弯插; JLCPCB Part Class: 扩展库; Datasheet: https://item.szlcsc.com/datasheet/U-USBAR04P-F002/360843.html; Supplier: LCSC; Connector Type: Type-A; Protocol Standard: USB 2.0; Gender: 母; Mounting Type: 弯插; Number of Contacts: 4P; Number of Ports: 1; Current Rating-Power: 1.5A; Voltage Rating: 30V; Length: 14mm; Detection color: 白色; Operating Temperature: 0℃~+50℃
USB2 = TYPE-C 16PIN 2MD(073): 连接器类型:Type-C;标准:-;公母:母;端口数量:1;触点数量:16P;安装方式:卧贴;额定电流 - 电源:5A;工作温度范围:-25℃~+85℃;; LCSC Part Name: Type-C 母 卧贴; Supplier Part: C2765186; Manufacturer: SHOU HAN(首韩); Supplier Footprint: SMD; JLCPCB Part Class: Extended Part; Datasheet: https://atta.szlcsc.com/upload/public/pdf/source/20211123/39B17C16241EAC15C5E277BDA434118E.pdf; Supplier: LCSC; Connector Type: Type-C; Gender: 母; Number of Ports: 1; Number of Contacts: 16P; Mounting Style: 卧贴; Current Rating - Power (Max): 5A; Operating Temperature Range: -25℃~+85℃
Y1 = 8M: Crystal Oscillator; Published: 8-Jun-2000; LatestRevisionDate: 17-Jul-2002; LatestRevisionNote: Re-released for DXP Platform.; PackageReference: R38; Publisher: Altium Limited; Origin Footprint 2: R38; Origin Footprint 3: XTAL-49S; Design Item ID: XTAL; Library Name: Miscellaneous Devices
Y2 Y3 = 12M: Crystal Oscillator; Published: 8-Jun-2000; LatestRevisionDate: 17-Jul-2002; LatestRevisionNote: Re-released for DXP Platform.; PackageReference: R38; Publisher: Altium Limited; Origin Footprint 2: R38; Origin Footprint 3: XTAL-49S; Design Item ID: XTAL; Library Name: Miscellaneous Devices

## Nets
3V3: C1.1 C2.2 C17.1 C18.1 C19.1 C20.1 H1.2 R1.1 R5.1 R9.1 R17.1 R18.1 R22.1 R24.1 R25.1 R26.1 R33.2 R51.2 R56.2 U1.2(OUT) U1.4(=) U10.9(VDDA) U10.24(VDD_1) U10.36(VDD_2) U10.48(VDD_3) U15.1(VDDA) U16.9(V3) U16.28(VCC)
5V_USB: D13.5(VBUS) R50.1 R59.1 USB2.2(VBUS) USB2.11(VBUS)
5V_VCC: C3.1 C10.2 C11.1 C13.2 C22.2 C23.1 C26.2 C28.1 C38.2 D6.2 D12.5(VBUS) H3.5 H3.6 H3.7 H4.2 H6.5 H6.6 H6.7 H7.2 H8.5 H8.6 H8.7 H9.2 H10.5 H10.6 H10.7 H11.2 L1.1 R4.1 R12.2 R21.1 R23.1 R50.2 R57.2 R58.2 R66.1 R71.1 U1.3(IN) U5.3(FB) U11.5(VCC) U15.16(VDDB) U18.5(VCC) U19.5(VCC) U20.16(VCC) U22.5(VCC) U24.8(V5V) USB1.1(VCC)
12V: C5.1 C42.1 R69.2 U2.3(OUT)
12V_GP: R69.1 U24.4(VCC)
24V_D1: C6.1 C7.1 D2.2 R3.1 U5.1(VIN)
24V_D2: C14.1 C16.1 C25.1 C27.1 D7.2 H4.8 H7.8 H9.8 H11.8
24V_D4: C4.1 CN1.3 D37.2 P17.1(VBUS) R16.2 U2.1(IN)
24V_SW: P9.1 P10.2
24V_VCC: C12.1 D2.1 D7.1 D17.1(K) D37.1 P10.1 R14.2
GND: C1.2 C2.1 C3.2 C4.2 C5.2 C6.2 C7.2 C8.1 C9.1 C10.1 C11.2 C12.2 C13.1 C14.2 C15.1 C16.2 C17.2 C18.2 C19.2 C20.2 C21.1 C22.1 C23.2 C24.1 C25.2 C26.1 C27.2 C28.2 C29.2 C31.1 C33.1 C34.1 C36.2 C37.1 C38.1 C42.2 CN1.2 D5.1 D6.1 D10.1 D11.1 D12.2(GND) D13.2(GND) D16.2 D17.2(A) D18.2 D19.2 D20.2 D21.2 D22.2 D23.2 D24.2 D25.2 D26.2 D27.2 D28.2 D29.2 D30.2 D31.2 D32.2 D33.2 D38.2(A) DC1.2 DC1.3 H1.1 H2.2 H4.1 H4.7 H7.1 H7.7 H9.1 H9.7 H11.1 H11.7 LED1.1(K) LED2.1(K) LED3.1(K) P1.2 P2.2 P3.2 P4.1 P5.2 P6.2 P7.1 P8.2 P11.2 P13.1 P13.2 P17.4(GND) P17.5(GND) P17.6(GND) R15.1 R27.1 R28.1 R29.1 R30.1 R31.2 R32.2 R40.1 R41.1 R42.1 R43.1 R44.2 R45.1 R46.1 R47.1 R48.1 R49.2 R52.1 R53.1 R54.1 R55.1 R65.2 U1.1(GND) U2.2(TAB) U3.3 U4.3 U5.5(GND) U5.6(GND) U5.7(GND) U5.8(GND) U6.2 U8.2 U8.3 U9.3 U10.8(VSSA) U10.23(VSS_1) U10.35(VSS_2) U10.47(VSS_3) U11.3(GND) U12.3 U13.3 U14.2 U14.3 U15.8(GNDA) U15.9(GNDB) U16.12(GND) U18.3(GND) U19.3(GND) U20.1(GND) U21.15(GND) U22.3(GND) U24.5(GND) USB1.4(GND) USB1.5(SH1) USB1.6(SH2) USB2.1(GND) USB2.12(GND) USB2.13(SHELL) USB2.14(SHELL)
VCC_LIMT: P1.3 P2.3 P3.3 P5.3 P6.3 P8.3 R2.1 R3.2 R4.2 R6.1 R19.1
VIN24V: DC1.1 P9.2
340_R: D14.2(A) R58.1 U20.3(RXD)
340_T: D15.1(K) U20.2(TXD)
A_1A: D32.1 H11.4 P16.3 R54.2
A_1B: D33.1 H11.3 P16.4 R55.2
A_2A: D31.1 H11.5 P16.2 R53.2
A_2B: D30.1 H11.6 P16.1 R52.2
A_DIR_O: H10.1 U19.4(Y)
A_STEP_O: H10.2 U15.15(VO1)
BOOT0: R31.1 U10.44(BOOT0)
BOOT1: R32.1 U10.20(PB2/BOOT1)
CC1: USB2.4(CC1)
CC2: USB2.10(CC2)
D1+: D12.3(I/O2) USB1.3(D+)
D1-: D12.1(I/O1) USB1.2(D-)
DN-: D13.3(I/O2) USB2.5(DN2) USB2.7(DN1)
DN_D-: D13.4(I/O2) U20.6(UD-)
DP+: D13.1(I/O1) USB2.6(DP1) USB2.8(DP2)
DP_D+: D13.6(I/O1) U20.5(UD+)
DTR: C30.2 U20.13(DTR#)
INT: R35.1 U10.33(PA12)
INT_CH: R35.2 U16.1(INT#)
LA_CNC_SW: D11.2 P11.1 P13.3 U12.2
LASER_CNC: R22.2 U10.46(PB9) U12.4
LED_RUN: D9.2 U10.38(PA15/JTDI)
M_EN_O: H3.8 H6.8 H8.8 H10.8 U11.4(Y)
MA_DIR: R49.1 U10.17(PA7) U19.2(A)
MA_STEP: U10.16(PA6) U15.2(VI1)
MOTOR_EN: R26.2 U10.28(PB15) U11.2(A)
MX_DIR: R44.1 U10.10(PA0-WKUP) U18.2(A)
MX_STEP: U10.11(PA1) U15.7(VI6)
MY_DIR: U10.12(PA2) U15.6(VI5)
MY_STEP: U10.13(PA3) U15.5(VI4)
MZ_DIR: U10.14(PA4) U15.4(VI3)
MZ_STEP: U10.15(PA5) U15.3(VI2)
NRST: C15.2 R33.1 U10.7(NRST)
PB1: U10.19(PB1)
PC13: U10.2(PC13-TAMPER-RTC)
PC14: U10.3(PC14-OSC32_IN)
PC15: U10.4(PC15-OSC32_OUT)
PROBE: R24.2 U10.18(PB0) U13.4
PROBE_OUT: D8.1(K) D10.2 H2.1 U14.1
PWM_3V3: R9.2 R63.1 U10.29(PA8) U22.2(A)
PWM_5V: CN1.1 D16.1 U22.4(Y)
PWM_10V: D38.1(K) P4.2 R67.2
PWM_GP: R65.1 U6.3 U24.3(PWM)
R1IN: U21.13(R1IN)
R1OUT: U21.12(R1OUT)
R2IN: P17.2(D-) U21.8(R2IN)
R2OUT: R61.1 U21.9(R2OUT)
RS232_VCC: C33.2 R56.1 R57.1 U21.16(VCC)
RST_340: C30.1 U10.45(PB8)
RST_376: R34.1 U10.43(PB7)
RSTI: R34.2 U16.2(RSTI)
RXD1: D15.2(A) R51.1 U10.31(PA10)
RXD3: H5.2 R61.2 U10.22(PB11)
SCK: R39.1 U16.20(SCK/D5)
SDI: R38.1 U16.21(SDI/D6)
SDO: R37.1 U16.22(SDO/D7)
SM_XC: R17.2 U8.1 U10.32(PA11)
SM_XC_OUT: P7.2 R16.1 U8.4
SPI1_CS: U10.42(PB6) U16.18(SCS/D3)
SPI1_MISO: R37.2 U10.40(PB4/JNTRST)
SPI1_MOSI: R38.2 U10.41(PB5)
SPI1_SCK: R39.2 U10.39(PB3/JTDO)
SWCLK: H1.3 U10.37(PA14/JTCK/SWCLK)
SWDIO: H1.4 U10.34(PA13/JTMS/SWDIO)
T1IN: U21.11(T1IN)
T1OUT: U21.14(T1OUT)
T2IN: R60.1 U21.10(T2IN)
T2OUT: P17.3(D+) U21.7(T2OUT)
TXD1: D14.1(K) U10.30(PA9)
TXD3: H5.1 R60.2 U10.21(PB10)
U_D+: D12.4(I/O2) U16.10(UD+)
U_D-: D12.6(I/O1) U16.11(UD-)
X_1A: D20.1 H4.4 P12.3 R29.2
X_1B: D21.1 H4.3 P12.4 R30.2
X_2A: D19.1 H4.5 P12.2 R28.2
X_2B: D18.1 H4.6 P12.1 R27.2
X_DIR_O: H3.1 U18.4(Y)
X_LIMT: R1.2 U3.4 U10.27(PB14)
X_LIMT_I: P1.1 P2.1 U3.2
X_STEP_O: H3.2 U15.10(VO6)
XTAL1: C9.2 U10.5(OSC_IN/PD0) Y1.1(OSC1)
XTAL2: C8.2 U10.6(OSC_OUT/PD1) Y1.2(OSC2)
Y_1A: D28.1 H7.4 P14.3 R42.2
Y_1B: D29.1 H7.3 P14.4 R43.2
Y_2A: D27.1 H7.5 P14.2 R41.2
Y_2B: D26.1 H7.6 P14.1 R40.2
Y_DIR_O: H6.1 U15.11(VO5)
Y_LIMT: R5.2 U4.4 U10.26(PB13)
Y_LIMT_I: P3.1 P5.1 U4.2
Y_STEP_O: H6.2 U15.12(VO4)
Z_1A: D24.1 H9.4 P15.3 R47.2
Z_1B: D25.1 H9.3 P15.4 R48.2
Z_2A: D23.1 H9.5 P15.2 R46.2
Z_2B: D22.1 H9.6 P15.1 R45.2
Z_DIR_O: H8.1 U15.13(VO3)
Z_LIMT: R18.2 U9.4 U10.25(PB12)
Z_LIMT_I: P6.1 P8.1 U9.2
Z_STEP_O: H8.2 U15.14(VO2)
Net-(C21-2): C21.2 U16.13(XI) Y2.2(OSC2)
Net-(C24-2): C24.2 U16.14(XO) Y2.1(OSC1)
Net-(C29-1): C29.1 U20.4(V3)
Net-(C31-2): C31.2 U21.2(V+)
Net-(C32-1): C32.1 U21.1(C1+)
Net-(C32-2): C32.2 U21.3(C1-)
Net-(C34-2): C34.2 U20.7(XI) Y3.2(OSC2)
Net-(C35-1): C35.1 U21.4(C2+)
Net-(C35-2): C35.2 U21.5(C2-)
Net-(C36-1): C36.1 U21.6(V-)
Net-(C37-2): C37.2 U20.8(XO) Y3.1(OSC1)
Net-(D5-2): D5.2 L1.2 U5.2(OUTPUT)
Net-(D8-2): D8.2(A) U13.2
Net-(D9-1): D9.1 R25.2
Net-(H3-3): H3.3 H3.4
Net-(H6-3): H6.3 H6.4
Net-(H8-3): H8.3 H8.4
Net-(H10-3): H10.3 H10.4
Net-(LED1-2): LED1.2(A) R12.1
Net-(LED2-2): LED2.2(A) R14.1
Net-(LED3-2): LED3.2(A) R59.2
Net-(R2-2): R2.2 U3.1
Net-(R6-2): R6.2 U4.1
Net-(R15-2): R15.2 U5.4(ON/OFF)
Net-(R19-2): R19.2 U9.1
Net-(R21-2): R21.2 U12.1
Net-(R23-2): R23.2 U13.1
Net-(R36-1): R36.1 U16.24(ACT#)
Net-(R63-2): R63.2 U6.1
Net-(R66-2): R66.2 U24.2(EN)
Net-(R67-1): R67.1 U24.6(VOUT)
Net-(R71-2): R71.2 U6.4

Not connected (* = marked no-connect by the designer): R36 2; U10 1(VBAT); U11 1(NC); U16 3(WR#) 4(RD#) 5(TXD) 6(RXD) 7(SD_DI) 8(A0) 15(D0) 16(D1) 17(D2) 19(BZ/D4) 23(SD-CS) 25(SD-DO) 26(SD-CK) 27(PCS#); U18 1(NC); U19 1(NC); U20 9(CTS#) 10(DSR#) 11(RI#) 12(DCD#) 14(RTS#) 15(R232); U22 1(NC); U24 1(NC)* 7(NC)*; USB2 3(SBU2)* 9(SBU1)*

## Notes on the sheet
- 两个端子分别插：船形开关、急停开关
- 加了TVS管
- 激光器接口
- 如果用光电开关，输入电压可选
- PWM信号3.3V升到5V给激光器，用于5KHz的PWM信号传输足够
- 24V转5V
- 输入口，3路限位开关检测
- 变频器端子
- PWM信号输出给变频器（最高电压由3.3变成变频器最高的10~12V）
- 输出口，开关信号给吸尘器
- 24V给电机供电
- 激光和CNC切换输入检测
- TVS二极管 + 下拉电阻组合，是经典的步进电机驱动保护方式
- 单片机LDO电源3.3V
- 驱动选用量产的HR4988模块
- 输入口，对刀检测
- 串口3和触摸屏通信
- 输入口，激光和CNC切换检测
- 串口1和电脑通信
- 3.3V驱动信号必须要升到5V，芯片也有隔离作用
  支持高速电机脉冲信号（已量产使用）
- 拨码开关
- 量产批量芯片
- 3.3V升到5V，用于控制方向信号做够
- 3.3V升到5V，用于控制方向信号做够
- 电机使能，使能信号和方向信号属于低速信号
- USB接口，插U盘
- 4路插件模块化电机驱动
- TYPE-C接口，用于上位机通信，用贴片的或者长腿插件
- 用D形口的USB传输电源和信号，连接触摸屏
- 电源和信号传输给触摸屏通信
